# Altium schematic sheet llrf_afe_dds_clock.SchDoc: =GlobalProjectName
size 209 x 297 mm; SheetNumber: 11; SheetTotal: 17; PageSetup: Record=PageOptions|CenterHorizontal=True|CenterVertical=True|PrintScale=1.00|XCorrection=1.00|YCorrection=1.00|PrintKind=1|BorderSize=5000000|LeftOffset=0|BottomOffset=0|Orientation=2|PaperLength=1000|PaperWidth=1000|Scale=100|PaperSource=15|PrintQuality=1200|MediaType=1|DitherType=10|PaperKind=A3|PrintScaleMode=1; Weight: -; ScaleFactor: -
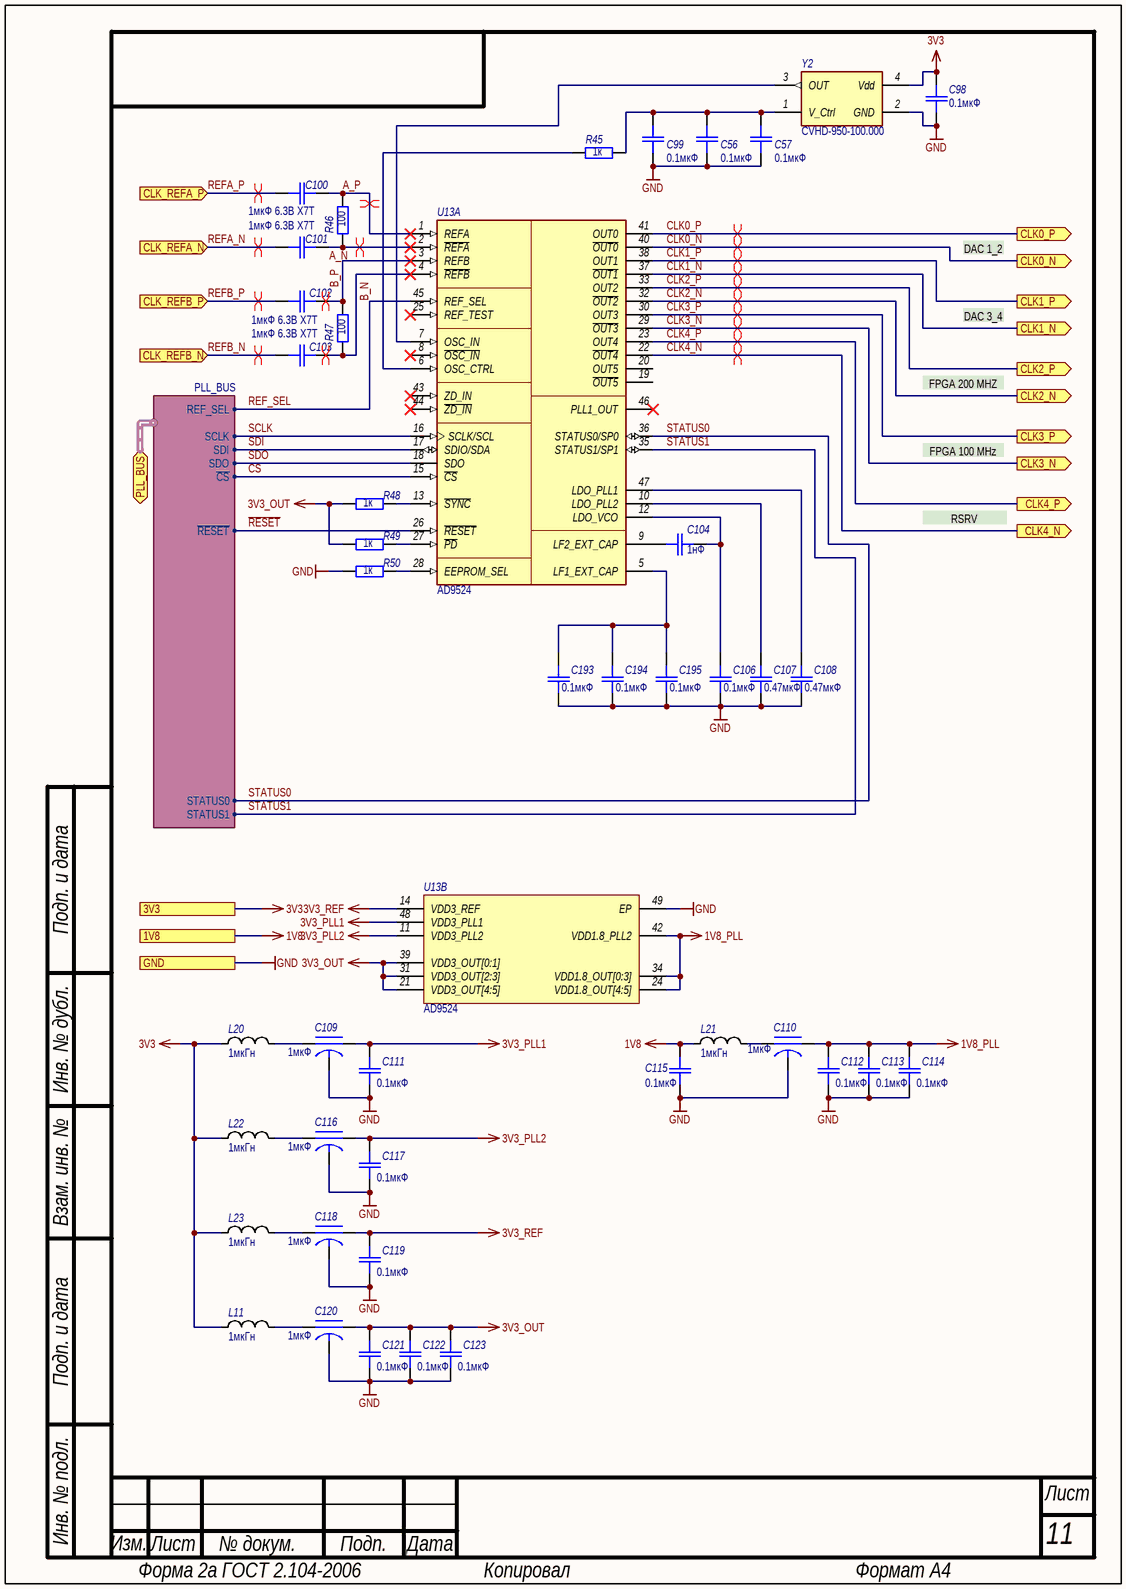
[diagram p0: llrf_afe_dds_clock.SchDoc]

## Parts
C56  0.1мкФ  [SMD_C0603]
C57  0.1мкФ  [SMD_C0603]
C98  0.1мкФ  [SMD_C0402]
C99  0.1мкФ  [SMD_C0603]
C100  1мкФ 6.3В X7T  [SMD_C0603]
C101  1мкФ 6.3В X7T  [SMD_C0603]
C102  1мкФ 6.3В X7T  [SMD_C0603]
C103  1мкФ 6.3В X7T  [SMD_C0603]
C104  1нФ  [SMD_C0402]
C106  0.1мкФ  [SMD_C0402]
C107  0.47мкФ  [SMD_C0402]
C108  0.47мкФ  [SMD_C0402]
C109  value 1мкФ  [3pol_SMD0402]  (hidden comment: NFM15PC105D0J3)
C110  value 1мкФ  [3pol_SMD0402]  (hidden comment: NFM15PC105D0J3)
C111  0.1мкФ  [SMD_C0402]
C112  0.1мкФ  [SMD_C0402]
C113  0.1мкФ  [SMD_C0402]
C114  0.1мкФ  [SMD_C0402]
C115  0.1мкФ  [SMD_C0402]
C116  value 1мкФ  [3pol_SMD0402]  (hidden comment: NFM15PC105D0J3)
C117  0.1мкФ  [SMD_C0402]
C118  value 1мкФ  [3pol_SMD0402]  (hidden comment: NFM15PC105D0J3)
C119  0.1мкФ  [SMD_C0402]
C120  value 1мкФ  [3pol_SMD0402]  (hidden comment: NFM15PC105D0J3)
C121  0.1мкФ  [SMD_C0402]
C122  0.1мкФ  [SMD_C0402]
C123  0.1мкФ  [SMD_C0402]
C193  0.1мкФ  [SMD_C0402]
C194  0.1мкФ  [SMD_C0402]
C195  0.1мкФ  [SMD_C0402]
L11  1мкГн  [SMD_0805]
L20  1мкГн  [SMD_0805]
L21  1мкГн  [SMD_0805]
L22  1мкГн  [SMD_0805]
L23  1мкГн  [SMD_0805]
R45  1к  [SMD_0603]
R46  100  [SMD_0603]
R47  100  [SMD_0603]
R48  1к  [SMD_0603]
R49  1к  [SMD_0603]
R50  1к  [SMD_0603]
U13  AD9524BCPZ  [QFN-48]  (value not drawn)  (parts A,B of 2)
Y2  CVHD-950-100.000  [FP-CVHD-950]

## Ports
1V8, 3V3, CLK0_N (out), CLK0_P (out), CLK1_N (out), CLK1_P (out), CLK2_N (out), CLK2_P (out), CLK3_N (out), CLK3_P (out), CLK4_N (out), CLK4_P (out), CLK_REFA_N (in), CLK_REFA_P (in), CLK_REFB_N (in), CLK_REFB_P (in), GND, PLL_BUS (bidir, harness PLL_BUS)

## Harnesses
PLL_BUS: ~{CS}, SCLK, SDI, SDO, ~{RESET}, STATUS0, STATUS1, REF_SEL

## Nets
1V8: C115.2 L21.1 ; port 1V8
1V8_PLL: C110.3(Output) C112.2 C113.2 C114.2 U13.24(VDD1.8_OUT[4:5]) U13.34(VDD1.8_OUT[0:3]) U13.42(VDD1.8_PLL2)
3V3: C98.2 L11.1 L20.1 L22.1 L23.1 Y2.4(Vdd) ; port 3V3
3V3_OUT: C120.3(Output) C121.2 C122.2 C123.2 R48.2 R49.2 U13.21(VDD3_OUT[4:5]) U13.31(VDD3_OUT[2:3]) U13.39(VDD3_OUT[0:1])
3V3_PLL1: C109.3(Output) C111.2 U13.48(VDD3_PLL1)
3V3_PLL2: C116.3(Output) C117.2 U13.11(VDD3_PLL2)
3V3_REF: C118.3(Output) C119.2 U13.14(VDD3_REF)
GND: C56.2 C57.2 C98.1 C99.2 C106.1 C107.1 C108.1 C109.2(GND) C110.2(GND) C111.1 C112.1 C113.1 C114.1 C115.1 C116.2(GND) C117.1 C118.2(GND) C119.1 C120.2(GND) C121.1 C122.1 C123.1 C193.1 C194.1 C195.1 R50.2 U13.49(EP) Y2.2(GND) ; port GND
A_N: C101.2 R46.1 U13.2(~{REFA})
A_P: C100.1 R46.2 U13.1(REFA)
B_N: C103.2 R47.1 U13.4(~{REFB})
B_P: C102.1 R47.2 U13.3(REFB)
~{CS}: U13.15(~{CS}) ; port PLL_BUS.~{CS}
CLK0_N: U13.40(~{OUT0}) ; port CLK0_N
CLK0_P: U13.41(OUT0) ; port CLK0_P
CLK1_N: U13.37(~{OUT1}) ; port CLK1_N
CLK1_P: U13.38(OUT1) ; port CLK1_P
CLK2_N: U13.32(~{OUT2}) ; port CLK2_N
CLK2_P: U13.33(OUT2) ; port CLK2_P
CLK3_N: U13.29(~{OUT3}) ; port CLK3_N
CLK3_P: U13.30(OUT3) ; port CLK3_P
CLK4_N: U13.22(~{OUT4}) ; port CLK4_N
CLK4_P: U13.23(OUT4) ; port CLK4_P
~{RESET}: U13.26(~{RESET}) ; port PLL_BUS.~{RESET}
REF_SEL: U13.45(REF_SEL) ; port PLL_BUS.REF_SEL
REFA_N: C101.1 ; port CLK_REFA_N
REFA_P: C100.2 ; port CLK_REFA_P
REFB_N: C103.1 ; port CLK_REFB_N
REFB_P: C102.2 ; port CLK_REFB_P
SCLK: U13.16(SCLK/SCL) ; port PLL_BUS.SCLK
SDI: U13.17(SDIO/SDA) ; port PLL_BUS.SDI
SDO: U13.18(SDO) ; port PLL_BUS.SDO
STATUS0: U13.36(STATUS0/SP0) ; port PLL_BUS.STATUS0
STATUS1: U13.35(STATUS1/SP1) ; port PLL_BUS.STATUS1
NetC56_1: C56.1 C57.1 C99.1 R45.1 Y2.1(V_Ctrl)
NetC104_1: C104.1 C106.2 U13.12(LDO_VCO)
NetC104_2: C104.2 U13.9(LF2_EXT_CAP)
NetC107_2: C107.2 U13.10(LDO_PLL2)
NetC108_2: C108.2 U13.47(LDO_PLL1)
NetC109_1: C109.1(Input) L20.2
NetC110_1: C110.1(Input) L21.2
NetC116_1: C116.1(Input) L22.2
NetC118_1: C118.1(Input) L23.2
NetC120_1: C120.1(Input) L11.2
NetC193_2: C193.2 C194.2 C195.2 U13.5(LF1_EXT_CAP)
NetR45_2: R45.2 U13.6(OSC_CTRL)
NetR48_1: R48.1 U13.13(~{SYNC})
NetR49_1: R49.1 U13.27(~{PD})
NetR50_1: R50.1 U13.28(EEPROM_SEL)
NetU13_7: U13.7(OSC_IN) Y2.3(OUT)

Not connected (* = marked no-connect by the designer): U13 8(~{OSC_IN})* 19(~{OUT5}) 20(OUT5) 25(REF_TEST)* 43(ZD_IN)* 44(~{ZD_IN})* 46(PLL1_OUT)*

## Layout directives
differential pair: A_N, A_P, B_N, B_P, CLK0_N, CLK0_P, CLK1_N, CLK1_P, CLK2_N, CLK2_P, CLK3_N, CLK3_P, CLK4_N, CLK4_P, REFA_N, REFA_P, REFB_N, REFB_P

## Notes on the sheet
- DAC 1_2
- DAC 3_4
- FPGA 200 MHZ
- FPGA 100 MHz
- RSRV
- Подп. и дата
- Инв. № дубл.
- Взам. инв. №
- Инв. № подл.
- Изм.
- Лист
- № докум.
- Подп.
- Дата
- Форма 2а ГОСТ 2.104-2006
- Копировал
- Формат А4

## Library data of the parts
C56 C57 C98 C99 C104 C106-C108 C111-C115 C117 C119 C121-C123 C193-C195 = Capacitor: Назначение: SMD-конденсатор; Наименование: Конденсатор; Потребление, Вт: 0
  C56 C57 C98 C99 C106 C111-C115 C117 C119 C121-C123 C193-C195: Value: 0.1мкФ
  C104: Value: 1нФ
  C107 C108: Value: 0.47мкФ
C100-C103 = Capacitor: Назначение: SMD-конденсатор; Наименование: GRM033D70J105ME01; Потребление, Вт: 0; Value: 1мкФ 6.3В X7T
C109 C110 C116 C118 C120 = Capacitop_3Pol: Large Current 3 Terminals Low ESL Chip Multilayer Ceramic Capacitors for General Purpose, 0402, 2200pF, 20%, 10V; Потребление, Вт: 0.0; Назначение: 3 Terminals Low ESL Chip Multilayer Ceramic Capacitors (EMIFIL) for General Purpose; ComponentLink1Description: DataSheet; ComponentLink1URL: https://search.murata.co.jp/Ceramy/image/img/A01X/G101/ENG/NFM15CC222D1A3-01.pdf; Наименование: NFM15PC105D0J3; ComponentLink2Description: UsingMethod; ComponentLink2URL: https://article.murata.com/en-global/article/methods-of-using-low-esl-capacitors
L11 L20-L23 = Inductor: Наименование: Индуктивность; Назначение: SMD-индуктивность; Потребление, Вт: 0,010; Value: 1мкГн
R45-R50 = Resistor: Наименование: Резистор; Назначение: SMD-резистор; Потребление, Вт: 0,001
  R45 R48-R50: Value: 1к
  R46 R47: Value: 100
U13 = AD9524: 6 Differential / 13 LVCMOS Outputs, Dual Loop Clock Generator, 3.3 V Supply, Industrial, 48-pin QFN (CP-48-1), Reel; Manufacturer: Analog Devices; PartNumber: AD9524BCPZ-REEL7; Supply Voltage (V): 3.3; On-Chip VCO or DCO: Yes; Output Logic: LVCMOS, HSTL, LVDS, LVPECL; I/O Interface: Serial; # of Inputs: 1; # of Outputs: 13; Max f-out: 1 GHz; Потребление, Вт: 0.3; Mounting Technology: Surface Mount; ComponentLink1Description: Manufacturer URL; ComponentLink1URL: http://www.analog.com/en/index.html; PackageReference: CP-48-1; PackageDescription: 48-Pin Lead Frame Chip Scale Package, Body 7 x 7 mm, Pitch 0.5 mm; ComponentLink4Description: Product URL; ComponentLink4URL: http://www.analog.com/en/clock-and-timing/clock-generation-and-distribution/ad9524/products/product.html; Packing: Reel; Code_JEDEC: MO-220-VKKD-2; ComponentLink3URL: http:/www.analog.com/static/imported-files/packages/PKG_PDF/LFCSP(CP)/CP-48/CP_48_1.pdf; ComponentLink3Description: Package Specification; ComponentLink2URL: http://www.analog.com/static/imported-files/data_sheets/AD9524.pdf; ComponentLink2Description: Datasheet; DatasheetVersion: Rev. C; Назначение: 6 Differential / 13 LVCMOS Outputs, Dual Loop Clock Generator, 3.3 V Supply, Industrial, 48-pin QFN (CP-48-1), Reel; Наименование: AD9524
Y2 = CVHD-950: XTAL OSC VCXO 50.0000MHZ CMOS; Manufacturer: Crystek Corporation; Manufacturer Part Number: CVHD-950-50.000; Load Capacitance: 15pF; Frequency: 40-130MHz; Stability: 20ppm; Min Supply Voltage: 3V; Max Supply Current: 25mA; Max Supply Voltage: 3.6V; Поребление, Вт: 0.1; Назначение: XTAL OSC VCXO 50.0000MHZ CMOS; Наименование: CVHD-950-100.000; Category: Crys; Lead Free: Yes; Series: CVHD-950; Automotive: No; Device Class L3: Oscillators; Device Class L2: Crystals / Oscillators; Mouser Description: Xtal Osc Vcxo 50.0000MHZ Cmos; Temperature: 0°C to +70°C; Temperature Range High: +70°C; Device Class L1: Passive Components; Digikey Description: XTAL OSC VCXO 50.0000MHZ CMOS; Height: 5.3mm; Temperature Range Low: 0°C; ComponentLink2URL: http://www.crystek.com/crystal/spec-sheets/vcxo/CVHD-950.pdf; RoHS: TRUE; ComponentLink2Description: Datasheet; Package: CVHD-950-50.000; Octopart: https://octopart.com/cvhd-950-50.000-crystek+crystals-19185436